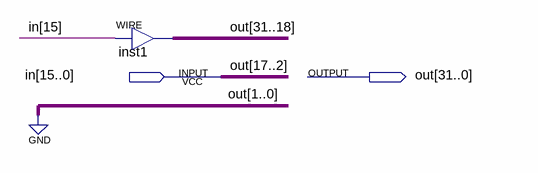
[diagram p0: schematic sheet]
// Quartus schematic ImmediateExtender.bdf as structural Verilog: 1 symbols, 2 pins
module ImmediateExtender (
  input  [15:0] in,
  output [31:0] out
);

  assign out[31:18] = {14{in[15]}};  // WIRE inst1

  assign out[17:0] = {in, 2'b00};
endmodule
